# EAGLE design MPR121-Cap-Touch-Keypad (EAGLE 6.4)
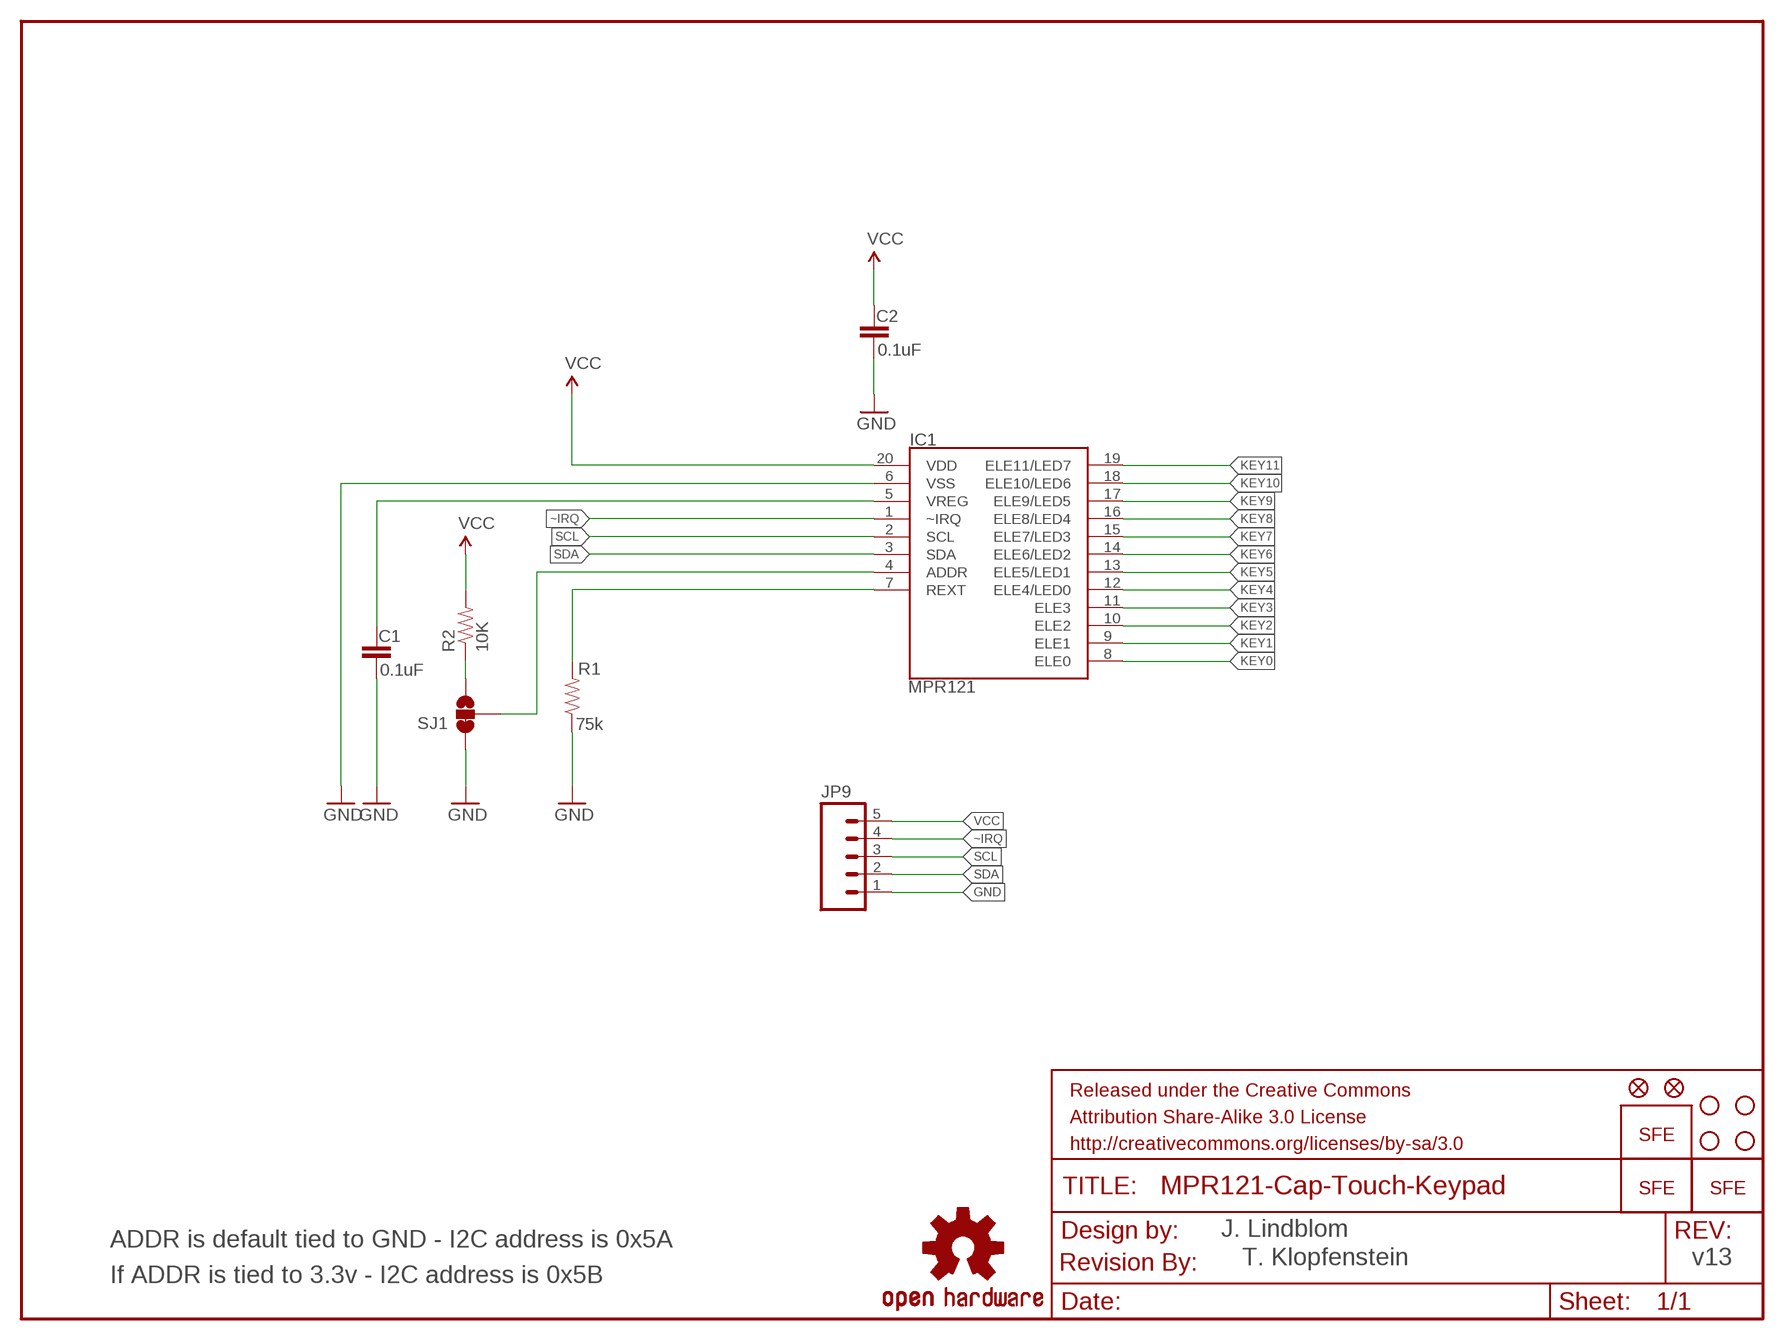
[diagram p0: schematic, sheet 1]

## Parts
C1  0.1uF  CAP0603-CAP  [0603-CAP]
C2  0.1uF  CAP0603-CAP  [0603-CAP]
FRAME1  FRAME-LETTER  [CREATIVE_COMMONS]
IC1  MPR121  MPR121V2  [QFN-20-0.4MM-V2]
JP1  LOGO-SFENEW  [SFE-NEW-WEBLOGO]
JP2  LOGO-SFESK  [SFE-LOGO-FLAME]
JP3  STAND-OFF  [STAND-OFF]
JP4  STAND-OFF  [STAND-OFF]
JP5  FIDUCIAL1X2  [FIDUCIAL-1X2]
JP6  LOGO-SFESK  [SFE-LOGO-FLAME]
JP7  STAND-OFF  [STAND-OFF]
JP8  STAND-OFF  [STAND-OFF]
JP9  M05PTH  [1X05]
JP10  FIDUCIAL1X2  [FIDUCIAL-1X2]
LOGO1  OSHW-LOGOL  [OSHW-LOGO-L]
R1  75k  RESISTOR0603-RES  [0603-RES]
R2  10K  10KOHM1/10W1%(0603)0603  [0603-RES]
SJ1  SOLDERJUMPER_2WAYPASTE1&2  [SJ_3_PASTE1&2]
U$1  REVISION  [REVISION]

## Nets
GND: C1.2 C2.2 IC1.6(VSS) JP9.1 R1.1 SJ1.1
KEY0: IC1.8(ELE0)
KEY1: IC1.9(ELE1)
KEY2: IC1.10(ELE2)
KEY3: IC1.11(ELE3)
KEY4: IC1.12(ELE4/LED0)
KEY5: IC1.13(ELE5/LED1)
KEY6: IC1.14(ELE6/LED2)
KEY7: IC1.15(ELE7/LED3)
KEY8: IC1.16(ELE8/LED4)
KEY9: IC1.17(ELE9/LED5)
KEY10: IC1.18(ELE10/LED6)
KEY11: IC1.19(ELE11/LED7)
N$1: IC1.4(ADDR) SJ1.2
N$2: R2.1 SJ1.3
REXT: IC1.7(REXT) R1.2
SCL: IC1.2(SCL) JP9.3
SDA: IC1.3(SDA) JP9.2
VCC: C2.1 IC1.20(VDD) JP9.5 R2.2
VREG: C1.1 IC1.5(VREG)
~IRQ: IC1.1(~IRQ) JP9.4

## Notes on the sheet
- J. Lindblom
- ADDR is default tied to GND - I2C address is 0x5A
- T. Klopfenstein | v13
- If ADDR is tied to 3.3v - I2C address is 0x5B

## Library data of the parts
C1 C2 = SparkFun:CAP: Capacitor Standard 0603 ceramic capacitor, and 0.1" leaded capacitor.
FRAME1 = SparkFun-Aesthetics:FRAME-LETTER: Schematic Frame Standard 8.5x11 US Letter frame
IC1 = SparkFun-Sensors:MPR121: MPR121 Capacitive Touch Sensor Controller. Variant "V2" was created using an image import of the bottom of the IC. It matches metal to metal.
JP1 JP2 JP6 = SparkFun:LOGO-SFE: Spark Fun Electronics PCB Logo This is the standard Spark Fun Electronics PCB logo.
JP3 JP4 JP7 JP8 = SparkFun:STAND-OFF: Stand Off This is the mechanical footprint for a #4 phillips button head screw. Use the keepout ring to avoid running the screw head into surrounding components. SKU : PRT-00447
JP5 JP10 = SparkFun:FIDUCIAL: Fiducial Alignment Points Various fiducial points for machine vision alignment.
JP9 = SparkFun:M05: Header 5 Standard 5-pin 0.1" header. Use with straight break away headers (SKU : PRT-00116), right angle break away headers (PRT-00553), swiss pins (PRT-00743), machine pins (PRT-00117), and female headers (PRT-00115). Molex polarized connector foot print use with SKU : PRT-08230 with associated crimp pins and housings.
LOGO1 = SparkFun-Aesthetics:OSHW-LOGO: Open Source Hardware Logo This logo indicates the piece of hardware it is found on incorporates a OSHW license and/or adheres to the definition of open source hardware found here: http://freedomdefined.org/OSHW
R1 = SparkFun:RESISTOR: Resistor Basic schematic elements and footprints for 0603, 1206, and PTH 1/10th watt (small) resistors.
R2 = SparkFun-Resistors:10KOHM1/10W1%(0603): RES-00824; PROD_ID: RES-00824
SJ1 = SparkFun-Passives:SOLDERJUMPER_2WAY: Solder Jumper 2 way solder jumper
U$1 = SparkFun-Aesthetics:REVISION

## Board
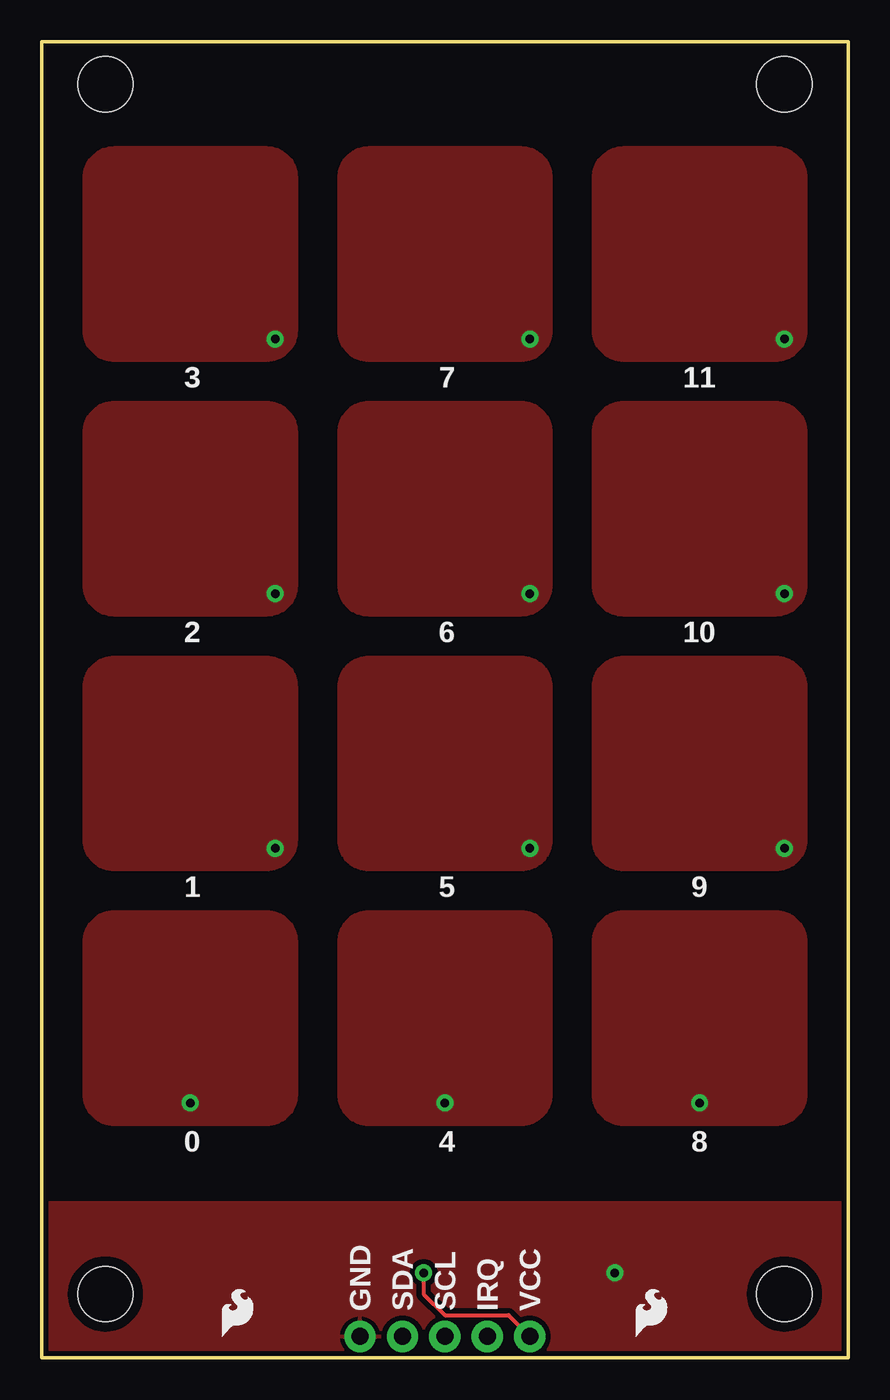
[diagram p1: board, top side]
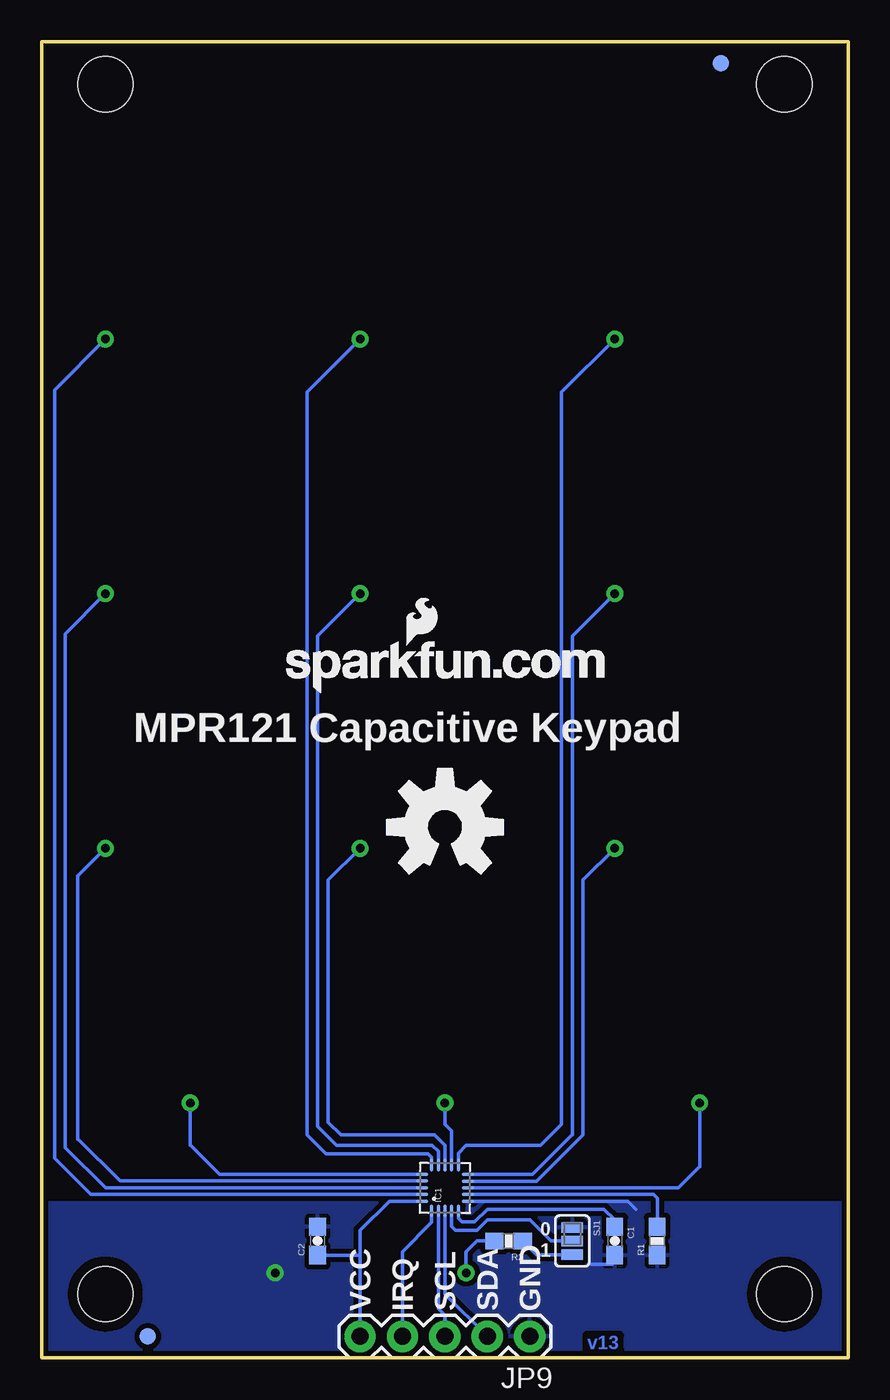
[diagram p2: board, bottom side, seen from below]

Size 48.26 x 78.74 mm. Coordinates in mm from the lower left corner, seen from the top.
Outline: 48.26,0 0,0 0,78.74 48.26,78.74 48.26,0
Copper layers (1*16): Top 0.035mm / dielectric 1.5mm / Bottom 0.035mm
Design rules "SparkFun *": minimum track width 8mil, minimum drill 20mil, track to track 8mil, track to pad 8mil, pad to pad 8mil, via to via 8mil, smd to smd 8mil, copper to edge 8mil, drill to drill 8mil, minimum pad ring 12mil, minimum via ring 10mil, stop-mask expansion 4mil, vias tented up to drill 20mil, thermal gap 10mil

### Footprints (pad centres in the part's own frame; a part is rotated, then mirrored left to right if it is on the bottom)
0603-CAP = smd 1.1 x 1: 1 -0.85,0; 2 0.85,0
QFN-20-0.4MM-V2 = smd 0.75 x 0.195: 1 -1.367,0.8; 2 -1.367,0.4; 3 -1.367,0; 4 -1.367,-0.4; 5 -1.367,-0.8; 11 1.375,-0.8; 12 1.375,-0.4; 13 1.375,0; 14 1.375,0.4; 15 1.375,0.8 | smd 0.195 x 0.75: 6 -0.795,-1.372; 7 -0.395,-1.372; 8 0.005,-1.372; 9 0.405,-1.372; 10 0.805,-1.372; 16 0.81,1.372; 17 0.41,1.372; 18 0.01,1.372; 19 -0.39,1.372; 20 -0.79,1.372
STAND-OFF = hole 3.302: 0,0
FIDUCIAL-1X2 = smd 1 x 1: 1 0,0
1X05 = drill 1.016 pad 1.88: 1 0,0; 2 2.54,0; 3 5.08,0; 4 7.62,0; 5 10.16,0
0603-RES = smd 1.1 x 1: 1 -0.85,0; 2 0.85,0
SJ_3_PASTE1&2 = smd 0.635 x 1.27: 1 -0.813,0; 2 0,0; 3 0.813,0

### Placement (x,y rotation side)
C1  13.97,6.99 270 bottom
C2  31.75,6.99 90 bottom
FRAME1  -0.3,-20.32 0 top  (outside the outline)
IC1  24.13,10.16 90 bottom
JP1  33.66,39.75 0 bottom
JP2  10.79,1.27 0 top
JP3  44.45,3.81 0 bottom
JP4  3.81,3.81 0 bottom
JP5  7.62,77.47 0 bottom
JP6  35.56,1.27 0 top
JP7  44.45,76.2 0 bottom
JP8  3.81,76.2 0 bottom
JP9  19.05,1.27 180 bottom
JP10  41.91,1.27 0 bottom
LOGO1  24.13,31.75 0 bottom
R1  11.43,6.99 90 bottom
R2  20.32,6.99 180 bottom
SJ1  16.51,6.99 270 bottom
U$1  11.43,-22.86 0 top  (outside the outline)

### Tracks (layer width: path | path; a pad name or v marks a point on that pad's centre or on a via)
GND  (via drill 0.51)
  Bottom 0.203: 14.1,5.59 15.37,5.59 | IC1.6 13.18,9.37 12.7,8.89
  other vias: 34.29,5.08
  pour Top (isolate 0.305): 48.26,0 48.13,9.27 0,9.27 0,0
  pour Bottom (isolate 0.305): 48.26,0 48.26,9.27 0,9.27 0,0
KEY0  (via drill 0.51)
  Bottom 0.203: v8.89,15.24 8.89,11.43 8.9,11.43 10.16,10.16 IC1.8
  pour Top (isolate 0.305): 13.44,13.97 arc90 15.24,15.77 15.24,24.87 arc90 13.44,26.67 4.34,26.67 arc90 2.54,24.87 2.54,15.77 arc90 4.34,13.97
KEY1  (via drill 0.51)
  Bottom 0.203: v13.97,30.48 15.88,28.57 15.88,13.34 18.66,10.56 IC1.9
  pour Top (isolate 0.305): 15.24,40.11 arc90 13.44,41.91 4.34,41.91 arc90 2.54,40.11 2.54,31.01 arc90 4.34,29.21 13.44,29.21 arc90 15.24,31.01
KEY2  (via drill 0.51)
  Bottom 0.203: v13.97,45.72 16.51,43.18 16.51,13.34 16.52,13.34 18.89,10.96 IC1.10
  pour Top (isolate 0.305): 15.24,55.35 arc90 13.44,57.15 4.34,57.15 arc90 2.54,55.35 2.54,46.25 arc90 4.34,44.45 13.44,44.45 arc90 15.24,46.25
KEY3  (via drill 0.51)
  Bottom 0.203: v13.97,60.96 17.14,57.78 17.14,13.97 18.41,12.7 22.86,12.7 23.33,12.23 IC1.11
  pour Top (isolate 0.305): 15.24,70.59 arc90 13.44,72.39 4.34,72.39 arc90 2.54,70.59 2.54,61.49 arc90 4.34,59.69 13.44,59.69 arc90 15.24,61.49
KEY4  (via drill 0.51)
  Bottom 0.203: v24.13,15.24 24.13,13.97 23.73,13.57 IC1.12
  pour Top (isolate 0.305): 28.68,13.97 arc90 30.48,15.77 30.48,24.87 arc90 28.68,26.67 19.58,26.67 arc90 17.78,24.87 17.78,15.77 arc90 19.58,13.97
KEY5  (via drill 0.51)
  Bottom 0.203: v29.21,30.48 31.11,28.57 31.11,14.1 30.35,13.34 24.77,13.34 24.13,12.7 IC1.13
  pour Top (isolate 0.305): 30.48,40.11 arc90 28.68,41.91 19.58,41.91 arc90 17.78,40.11 17.78,31.01 arc90 19.58,29.21 28.68,29.21 arc90 30.48,31.01
KEY6  (via drill 0.51)
  Bottom 0.203: v29.21,45.72 31.75,43.18 31.75,13.84 30.61,12.7 24.89,12.7 24.53,12.34 IC1.14
  pour Top (isolate 0.305): 30.48,55.35 arc90 28.68,57.15 19.58,57.15 arc90 17.78,55.35 17.78,46.25 arc90 19.58,44.45 28.68,44.45 arc90 30.48,46.25
KEY7  (via drill 0.51)
  Bottom 0.203: v29.21,60.96 32.38,57.78 32.38,13.34 31.24,12.19 25.15,12.19 24.93,11.98 IC1.15
  pour Top (isolate 0.305): 30.48,70.59 arc90 28.68,72.39 19.58,72.39 arc90 17.78,70.59 17.78,61.49 arc90 19.58,59.69 28.68,59.69 arc90 30.48,61.49
KEY8  (via drill 0.51)
  Bottom 0.203: v39.37,15.24 39.37,12.7 39.35,12.7 37.62,10.97 IC1.16
  pour Top (isolate 0.305): 45.72,24.87 arc90 43.92,26.67 34.82,26.67 arc90 33.02,24.87 33.02,15.77 arc90 34.82,13.97 43.92,13.97 arc90 45.72,15.77
KEY9  (via drill 0.51)
  Bottom 0.203: v44.45,30.48 46.1,28.83 46.1,13.08 46.08,13.08 43.57,10.57 IC1.17
  pour Top (isolate 0.305): 45.72,40.11 arc90 43.92,41.91 34.82,41.91 arc90 33.02,40.11 33.02,31.01 arc90 34.82,29.21 43.92,29.21 arc90 45.72,31.01
KEY10  (via drill 0.51)
  Bottom 0.203: v44.45,45.72 46.86,43.31 46.86,12.57 46.84,12.57 44.44,10.17 IC1.18
  pour Top (isolate 0.305): 33.02,46.25 arc90 34.82,44.45 43.92,44.45 arc90 45.72,46.25 45.72,55.35 arc90 43.92,57.15 34.82,57.15 arc90 33.02,55.35
KEY11  (via drill 0.51)
  Bottom 0.203: v44.45,60.96 47.5,57.91 47.5,11.94 45.33,9.77 IC1.19
  pour Top (isolate 0.305): 34.82,72.39 arc90 33.02,70.59 33.02,61.49 arc90 34.82,59.69 43.92,59.69 arc90 45.72,61.49 45.72,70.59 arc90 43.92,72.39
N$1
  Bottom 0.203: IC1.4 23.73,7.86 23.5,7.62 22.23,7.62 21.59,8.26 19.05,8.26 17.78,6.99 SJ1.2
N$2
  Bottom 0.203: SJ1.3 18.66,6.17 R2.1
REXT
  Bottom 0.203: R1.2 11.43,9.53 11.67,9.77 IC1.7
SCL
  Bottom 0.203: IC1.2 24.53,2.94 24.13,2.54 JP9.3
SDA
  Bottom 0.203: IC1.3 24.13,3.81 JP9.2
VCC  (via drill 0.51)
  Top 0.254: v22.86,5.08 22.86,3.81 24.13,2.54 27.94,2.54 JP9.5
  Bottom 0.203: IC1.20 27.46,9.37 29.21,7.62 29.21,6.1 | 29.21,6.1 JP9.5 | R2.2 22.23,6.99 22.86,6.35 v22.86,5.08 | C2.1 29.25,6.13 29.21,6.1
VREG
  Bottom 0.203: IC1.5 23.33,8.34 23.11,8.13 22.35,8.13 21.59,8.89 14.61,8.89 13.97,8.26 C1.1 13.97,7.62
~IRQ
  Bottom 0.203: IC1.1 24.93,8.09 26.67,6.35 JP9.4

### Text on the board
Bottom: v13
tPlace: 3 | 7 | 11 | 2 | 6 | 10 | 1 | 5 | 9 | 0 | 4 | 8 | GND | SDA | SCL | IRQ | VCC
bPlace: MPR121 Capacitive Keypad | 0 | 1 | GND | SDA | SCL | IRQ | VCC
Measures: All Dimensions in mil | 3100 | 3000 | 1150 | 1050 | 550 | 400 | 150 | 50 | 0 | 0 | 0 | 0 | 0 | 100 | 150 | 600 | 700 | 750 | 850 | 950 | 1050 | 1150 | 1750 | 1900
Document: J. Lindblom | T. Klopfenstein
Reference: vcc | irq | scl | sda | gnd